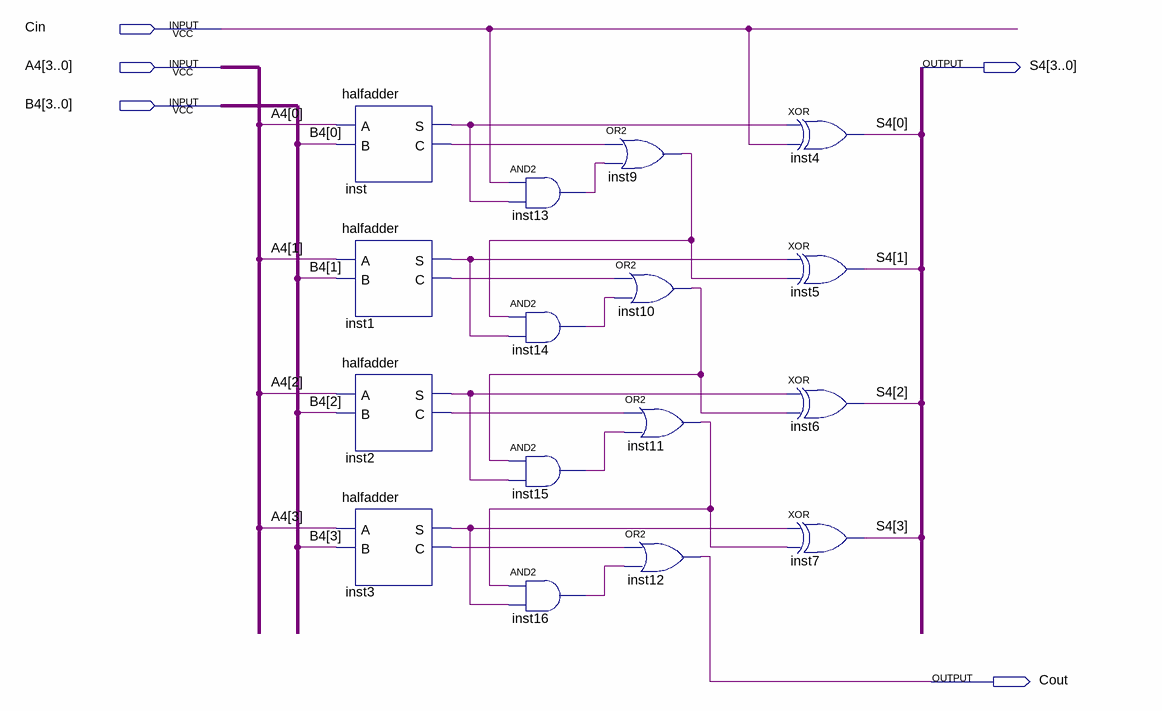
[diagram p0: schematic sheet]
// Quartus schematic claadder4.bdf as structural Verilog: 16 symbols, 5 pins
module claadder4 (
  input  Cin,
  input  [3:0] A4,
  input  [3:0] B4,
  output [3:0] S4,
  output Cout
);

  wire inst1_c, inst1_s, inst2_c, inst2_s, inst3_c, inst3_s, inst9_out, inst10_out, inst11_out, inst13_out,
       inst14_out, inst15_out, inst16_out, inst_c, inst_s;

  halfadder inst (.A(A4[0]), .B(B4[0]), .S(inst_s), .C(inst_c));
  halfadder inst1 (.A(A4[1]), .B(B4[1]), .S(inst1_s), .C(inst1_c));
  halfadder inst2 (.A(A4[2]), .B(B4[2]), .S(inst2_s), .C(inst2_c));
  halfadder inst3 (.A(A4[3]), .B(B4[3]), .S(inst3_s), .C(inst3_c));
  and inst13 (inst13_out, Cin, inst_s);
  and inst14 (inst14_out, inst9_out, inst1_s);
  and inst15 (inst15_out, inst10_out, inst2_s);
  and inst16 (inst16_out, inst11_out, inst3_s);
  or inst9 (inst9_out, inst_c, inst13_out);
  or inst10 (inst10_out, inst1_c, inst14_out);
  or inst11 (inst11_out, inst2_c, inst15_out);
  or inst12 (Cout, inst3_c, inst16_out);
  xor inst4 (S4[0], inst_s, Cin);
  xor inst5 (S4[1], inst1_s, inst9_out);
  xor inst6 (S4[2], inst2_s, inst10_out);
  xor inst7 (S4[3], inst3_s, inst11_out);
endmodule
